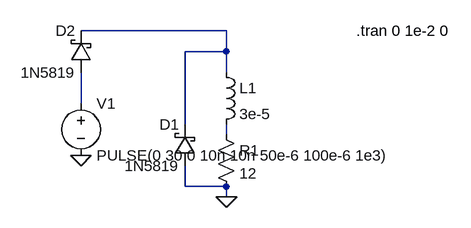
[diagram p0: schematic 20211119_solenoid_current_sim.asc]
20211119_solenoid_current_sim.asc, the LTspice schematic file:
Version 4
SHEET 1 880 680
WIRE 240 32 16 32
WIRE 240 64 240 32
WIRE 240 64 176 64
WIRE 240 96 240 64
WIRE 16 144 16 96
WIRE 176 176 176 64
WIRE 240 192 240 176
WIRE 176 272 176 240
WIRE 240 272 176 272
WIRE 240 288 240 272
FLAG 240 288 0
FLAG 16 224 0
SYMBOL ind 224 80 R0
SYMATTR InstName L1
SYMATTR Value 3e-5
SYMBOL res 224 176 R0
SYMATTR InstName R1
SYMATTR Value 12
SYMBOL voltage 16 128 R0
WINDOW 123 0 0 Left 0
WINDOW 39 0 0 Left 0
SYMATTR InstName V1
SYMATTR Value PULSE(0 30 0 10n 10n 50e-6 100e-6 1e3)
SYMBOL schottky 192 240 R180
WINDOW 0 24 64 Left 2
WINDOW 3 24 0 Left 2
SYMATTR InstName D1
SYMATTR Value 1N5819
SYMATTR Description Diode
SYMATTR Type diode
SYMBOL schottky 32 96 R180
WINDOW 0 24 64 Left 2
WINDOW 3 24 0 Left 2
SYMATTR InstName D2
SYMATTR Value 1N5819
SYMATTR Description Diode
SYMATTR Type diode
TEXT 440 32 Left 2 !.tran 0 1e-2 0

The netlist it stands for:
* 20211119_solenoid_current_sim.asc
L1 N001 N003 3e-5
R1 N003 0 12
V1 N002 0 PULSE(0 30 0 10n 10n 50e-6 100e-6 1e3)
D1 0 N001 1N5819
D2 N002 N001 1N5819
.model D D
.lib standard.dio
.tran 0 1e-2 0
.backanno
.end